# EAGLE design GPS_radiologger_v24_L70_CMWX_MAX_auto (EAGLE 9.6.2)
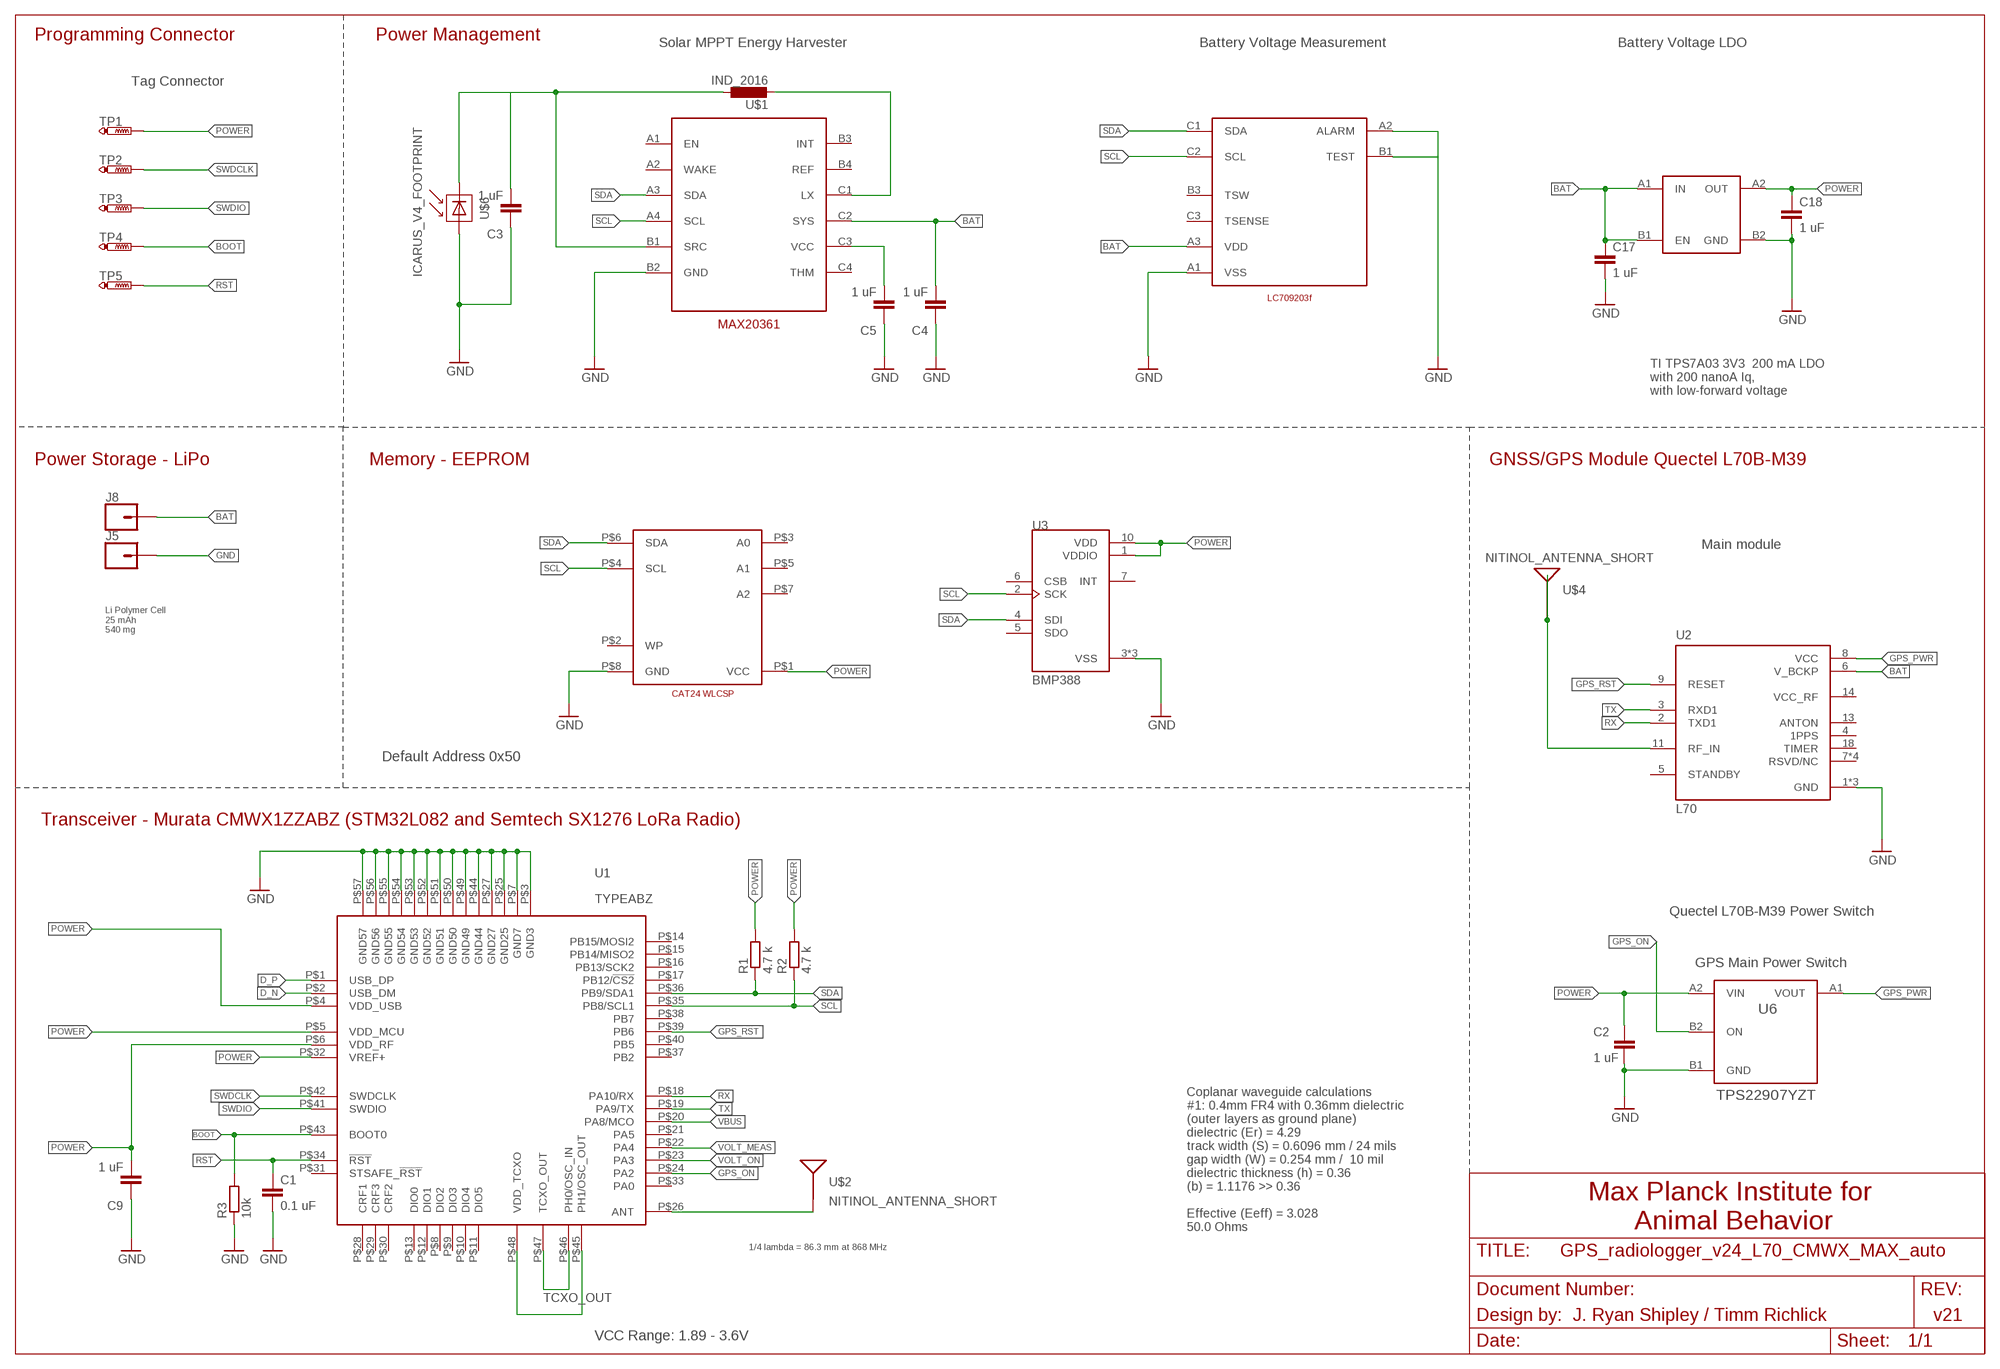
[diagram p0: schematic, sheet 1]

## Parts
C1  0.1 uF  C-EUC0201  [C0201]
C2  1 uF  C-EUC0201  [C0201]
C3  1 uF  C-EUC0201  [C0201]
C4  1 uF  C-EUC0201  [C0201]
C5  1 uF  C-EUC0201  [C0201]
C9  1 uF  C-EUC0201  [C0201]
C17  1 uF  0402CAP.KW  [0402-CAP]
C18  1 uF  0402CAP.KW  [0402-CAP]
J5  CONN_01PTH_NO_SILK_SMALL  [1X01_SMALL]
J8  CONN_01PTH_NO_SILK_SMALL  [1X01_SMALL]
R1  4.7 k  R-EU_R0201  [R0201]
R2  4.7 k  R-EU_R0201  [R0201]
R3  10k  R-EU_R0201  [R0201]
TP1  PTR1TP08SQ  [TP08SQ]
TP2  PTR1TP08SQ  [TP08SQ]
TP3  PTR1TP08SQ  [TP08SQ]
TP4  PTR1TP08SQ  [TP08SQ]
TP5  PTR1TP08SQ  [TP08SQ]
U1  TYPEABZ  [TYPEABZ]
U2  L70  [XCVR_L70]
U3  BMP388  [PQFN50P200X200X80-10N]
U6  TPS22907YZT  [YFP0004-DSBGA]
U$1  IND_2016  [INDC2016X120L]
U$2  NITINOL_ANTENNA_SHORT  [ICARUS_NITINOL_ANTENNA_SHORT]
U$3  TPS7A03-DSBGA  [BGA4N35P2X2_70X70X40N]
U$4  NITINOL_ANTENNA_SHORT  [ICARUS_NITINOL_ANTENNA_SHORT]
U$6  ICARUS_V4_FOOTPRINT  [ICARUS_FULL_FOOTPRINT]
U$7  LC709203F  [BGA9N50P3X3_160X175X50N]
U$8  MAX20361  [BGA12N40P4X3_123X163X64N]
U$9  CAT24_WLCSP8  [WLCSP8]

## Nets
BAT [battery]: C4.2 C17.1 J8.P$1 U2.6(V_BCKP) U$3.A1(IN) U$3.B1(EN) U$7.A3(VDD) U$8.C2(SYS)
BOOT: R3.2 TP4.TP U1.P$43(BOOT0)
D_N [diff_pair]: U1.P$2(USB_DM)
D_P [diff_pair]: U1.P$1(USB_DP)
GND: C1.2 C2.2 C3.1 C4.1 C5.1 C9.1 C17.2 C18.2 J5.P$1 R3.1 U1.P$3(GND3) U1.P$7(GND7) U1.P$25(GND25) U1.P$27(GND27) U1.P$44(GND44) U1.P$49(GND49) U1.P$50(GND50) U1.P$51(GND51) U1.P$52(GND52) U1.P$53(GND53) U1.P$54(GND54) U1.P$55(GND55) U1.P$56(GND56) U1.P$57(GND57) U2.1(GND) U2.10(GND) U2.12(GND) U3.3(VSS) U3.8(VSS) U3.9(VSS) U6.B1(GND) U$3.B2(GND) U$6.P$2(MINUS) U$7.A1(VSS) U$7.A2(ALARM) U$7.B1(TEST) U$8.B2(GND) U$9.P$8(GND)
GPS_ON: U1.P$24(PA2) U6.B2(ON)
GPS_PWR: U2.8(VCC) U6.A1(VOUT)
GPS_RST: U1.P$39(PB6) U2.9(RESET)
N$1: U1.P$45(PH1/OSC_OUT) U1.P$48(VDD_TCXO)
N$2 [antenna]: U2.11(RF_IN) U$4.1(SIGNAL) U$4.2(SIGNAL) U$4.3(SIGNAL)
N$3: U$1.2 U$8.C1(LX)
N$4: C5.2 U$8.C3(VCC)
N$11 [antenna]: U1.P$26(ANT) U$2.1(SIGNAL) U$2.2(SIGNAL) U$2.3(SIGNAL)
N$15 [battery]: C3.2 U$1.1 U$6.P$1(PLUS) U$8.B1(SRC)
POWER [power]: C2.1 C9.2 C18.1 R1.2 R2.2 TP1.TP U1.P$4(VDD_USB) U1.P$5(VDD_MCU) U1.P$6(VDD_RF) U1.P$32(VREF+) U3.1(VDDIO) U3.10(VDD) U6.A2(VIN) U$3.A2(OUT) U$9.P$1(VCC)
RST: C1.1 TP5.TP U1.P$34(!RST)
RX: U1.P$18(PA10/RX) U2.2(TXD1)
SCL: R2.1 U1.P$35(PB8/SCL1) U3.2(SCK) U$7.C2(SCL) U$8.A4(SCL) U$9.P$4(SCL)
SDA: R1.1 U1.P$36(PB9/SDA1) U3.4(SDI) U$7.C1(SDA) U$8.A3(SDA) U$9.P$6(SDA)
SWDCLK: TP2.TP U1.P$42(SWDCLK)
SWDIO: TP3.TP U1.P$41(SWDIO)
TCXO_OUT: U1.P$46(PH0/OSC_IN) U1.P$47(TCXO_OUT)
TX: U1.P$19(PA9/TX) U2.3(RXD1)
VBUS: U1.P$20(PA8/MCO)
VOLT_MEAS: U1.P$22(PA4)
VOLT_ON: U1.P$23(PA3)
Unconnected: U1.P$8(DIO2) U1.P$9(DIO3) U1.P$10(DIO4) U1.P$11(DIO5) U1.P$12(DIO1) U1.P$13(DIO0) U1.P$14(PB15/MOSI2) U1.P$15(PB14/MISO2) U1.P$16(PB13/SCK2) U1.P$17(PB12/!CS2) U1.P$21(PA5) U1.P$28(CRF1) U1.P$29(CRF3) U1.P$30(CRF2) U1.P$31(STSAFE_!RST) U1.P$33(PA0) U1.P$37(PB2) U1.P$38(PB7) U1.P$40(PB5) U2.4(1PPS) U2.5(STANDBY) U2.7(RSVD/NC) U2.13(ANTON) U2.14(VCC_RF) U2.15(RSVD/NC) U2.16(RSVD/NC) U2.17(RSVD/NC) U2.18(TIMER) U3.5(SDO) U3.6(CSB) U3.7(INT) U$7.B3(TSW) U$7.C3(TSENSE) U$8.A1(EN) U$8.A2(WAKE) U$8.B3(INT) U$8.B4(REF) U$8.C4(THM) U$9.P$2(WP) U$9.P$3(A0) U$9.P$5(A1) U$9.P$7(A2)

## Notes on the sheet
- Programming Connector | Power Management
- Solar MPPT Energy Harvester | Battery Voltage Measurement | Battery Voltage LDO
- Tag Connector
- TI TPS7A03 3V3  200 mA LDO
  with 200 nanoA Iq, 
  with low-forward voltage
- Power Storage - LiPo | Memory - EEPROM | GNSS/GPS Module Quectel L70B-M39
- Main module
- Li Polymer Cell
  25 mAh
  540 mg
- Default Address 0x50
- Transceiver - Murata CMWX1ZZABZ (STM32L082 and Semtech SX1276 LoRa Radio)
- Quectel L70B-M39 Power Switch
- GPS Main Power Switch
- Max Planck Institute for 
  Animal Behavior
- Coplanar waveguide calculations
  #1: 0.4mm FR4 with 0.36mm dielectric 
  (outer layers as ground plane)
  dielectric (Er) = 4.29
  track width (S) = 0.6096 mm / 24 mils
  gap width (W) = 0.254 mm /  10 mil
  dielectric thickness (h) = 0.36
  (b) = 1.1176 >> 0.36
  
  Effective (Eeff) = 3.028
  50.0 Ohms
- 1/4 lambda = 86.3 mm at 868 MHz
- Design by: | J. Ryan Shipley / Timm Richlick | v21
- VCC Range: 1.89 - 3.6V

## Library data of the parts
C1-C5 C9 = rcl:C-EU: CAPACITOR, European symbol; SPICEPREFIX: C
C17 C18 = SparkFun-Capacitors:0402CAP.KW
J5 J8 = SparkFun-Connectors:CONN_01: Single connection point. Often used as Generic Header-pin footprint for 0.1 inch spaced/style header connections On any of the 0.1 inch spaced packages, you can populate with these: Break Away Headers - Straight <https://www.sparkfun.com/products/116> (PRT-00116) Break Away Male Headers - Right Angle <https://www.sparkfun.com/products/553> (PRT-00553) Female Headers <https://www.sparkfun.com/products/115> (PRT-00115) Break Away Headers - Machine Pin <https://www.sparkfun.com/products/117> (PRT-00117) Break Away Female Headers - Swiss Machine Pin <https://www.sparkfun.com/products/743> (PRT-00743) This device is also useful as a general connection point to wire up your design to another part of your project. Our various solder wires solder well into these plated through hole pads. Hook-Up Wire - Assortment (Stranded, 22 AWG) <https://www.sparkfun.com/products/11375> (PRT-11375) Hook-Up Wire - Assortment (Solid Core, 22 AWG) <https://www.sparkfun.com/products/11367> (PRT-11367) View the entire wire category on our website here <https://www.sparkfun.com/categories/141> Special notes: SMTSO-256-ET is a "flush mount" nut for a 4-40 screw. We mostly use this on specialty testbeds; it is a nice way to connect hardware to your PCB at an adjustable hieght. Also note, the SNAP packages are for using a snappable style connector. We sell a baggie of snaps and they are also used on two LilyPad designs: Snap Assortment - 30 pack (male and female) <https://www.sparkfun.com/products/11347> (DEV-11347) LilyPad Arduino SimpleSnap <https://www.sparkfun.com/products/10941> (DEV-10941) LilyPad SimpleSnap Protoboard <https://www.sparkfun.com/products/10940> (DEV-10940)
R1-R3 = rcl:R-EU_: RESISTOR, European symbol; SPICEPREFIX: R
TP1-TP5 = testpad:PTR1: TEST PIN
U1 = Kris:TYPEABZ: CMWX1ZZABZ-078
U2 = L70:L70: GPS Module Check prices <https://pricing.snapeda.com/parts/L70/Quectel/view-part?ref=eda>; AVAILABILITY: Warning; DESCRIPTION: L70, an SMD type module, brings the high performance of MTK positioning engine to the industrial applications with compact profile, ultra low power consumption and fast positioning capability.; MF: Quectel; MP: L70; PACKAGE: 2920 Quectel; PRICE: None
U3 = BMP388:BMP388: P-Sensor SPI I2C 1, 25 Bar SMD; AVAILABILITY: Unavailable; DESCRIPTION: Pressure Sensor 4.35PSI ~ 18.13PSI (30kPa ~ 125kPa) Absolute 10-WFLGA; MF: Bosch Sensortec; MP: BMP388; PACKAGE: WFLGA-10 Bosch Tools; PRICE: None
U6 = TPS22916:TPS22907YZT
U$1 = Ryan_custom:IND_2016
U$2 U$4 = Antenna_mounts:NITINOL_ANTENNA_SHORT
U$3 = Ryan_custom:TPS7A03-DSBGA
U$6 = TrisolX_Solar_Cells:ICARUS_V4_FOOTPRINT
U$7 = Ryan_custom:LC709203F
U$8 = Ryan_custom:MAX20361
U$9 = Ryan_custom:CAT24_WLCSP8

## Net classes
1 power: width 0.152 mm
2 antenna: width 0.61 mm, clearance 0.254 mm
3 battery: width 0.152 mm
4 diff_pair: width 0.178 mm, clearance 0.152 mm

## Board
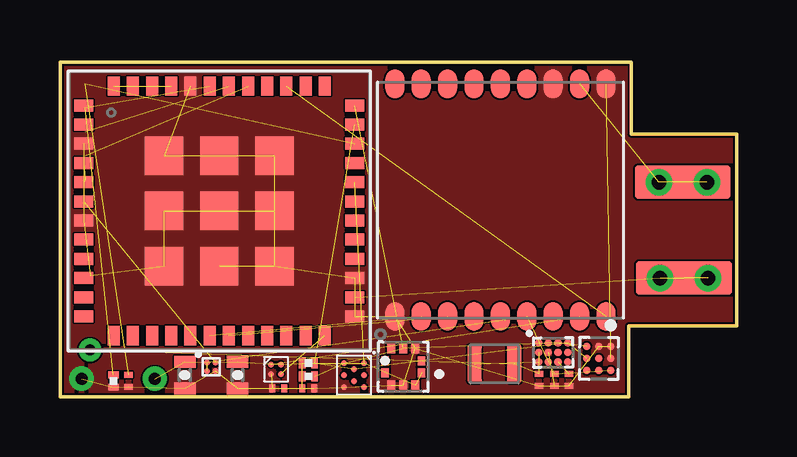
[diagram p1: board, top side]
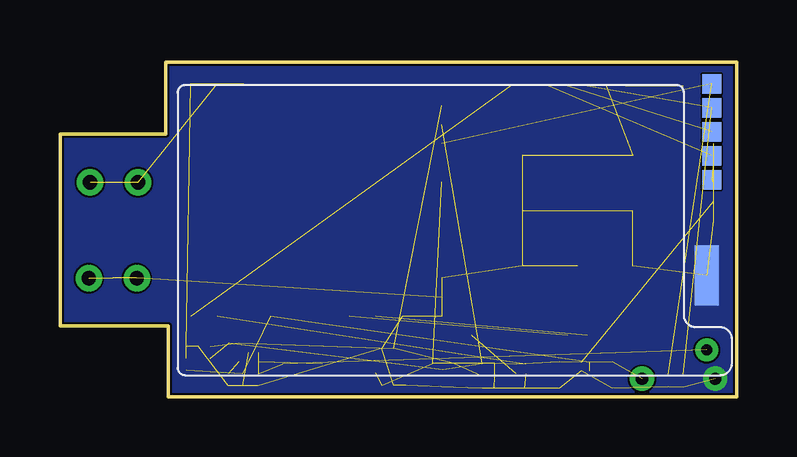
[diagram p2: board, bottom side, seen from below]

Size 28.2 x 13.95 mm. Coordinates in mm from the lower left corner, seen from the top.
Outline: 0,13.95 23.8,13.95 23.8,10.95 28.2,10.95 28.2,2.95 23.7,2.95 23.7,0 0,0 0,13.95
Copper layers (1*2+15*16): Top 0.035mm / dielectric 0.08mm / Route2 0.035mm / dielectric 0.08mm / Route15 0.035mm / dielectric 0.11mm / Bottom 0.035mm
Design rules "default *": minimum track width 5mil, minimum drill 0.15mm, track to track 3mil, track to pad 3mil, pad to pad 3mil, via to via 3mil, smd to smd 3mil, copper to edge 3mil, drill to drill 3mil, minimum pad ring 10mil, minimum via ring 3mil, stop-mask expansion 0mil, vias tented up to drill 20mil, thermal gap 0mil

### Footprints (pad centres in the part's own frame; a part is rotated, then mirrored left to right if it is on the bottom)
C0201 = smd 0.25 x 0.35: 1 -0.25,0; 2 0.25,0
0402-CAP = smd 0.5 x 0.9: 1 -0.55,0; 2 0.55,0
1X01_SMALL = drill 0.508: P$1 0,0
R0201 = smd 0.28 x 0.43: 1 -0.255,0; 2 0.255,0
TP08SQ = smd 0.8 x 0.8: TP 0,0
TYPEABZ = smd 0.8 x 0.5: P$1 -5.65,4.4; P$2 -5.65,3.6; P$3 -5.65,2.8; P$4 -5.65,2; P$5 -5.65,1.2; P$6 -5.65,0.4; P$7 -5.65,-0.4; P$8 -5.65,-1.2; P$9 -5.65,-2; P$10 -5.65,-2.8; P$11 -5.65,-3.6; P$12 -5.65,-4.4; P$25 5.65,-4.4; P$26 5.65,-3.6; P$27 5.65,-2.8; P$28 5.65,-2; P$29 5.65,-1.2; P$30 5.65,-0.4; P$31 5.65,0.4; P$32 5.65,1.2; P$33 5.65,2; P$34 5.65,2.8; P$35 5.65,3.6; P$36 5.65,4.4 | smd 0.5 x 0.8: P$13 -4.4,-5.2; P$14 -3.6,-5.2; P$15 -2.8,-5.2; P$16 -2,-5.2; P$17 -1.2,-5.2; P$18 -0.4,-5.2; P$19 0.4,-5.2; P$20 1.2,-5.2; P$21 2,-5.2; P$22 2.8,-5.2; P$23 3.6,-5.2; P$24 4.4,-5.2; P$37 4.4,5.2; P$38 3.6,5.2; P$39 2.8,5.2; P$40 2,5.2; P$41 1.2,5.2; P$42 0.4,5.2; P$43 -0.4,5.2; P$44 -1.2,5.2; P$45 -2,5.2; P$46 -2.8,5.2; P$47 -3.6,5.2; P$48 -4.4,5.2 | smd 1.6 x 1.6: P$49 -2.3,2.3; P$50 0,2.3; P$51 2.3,2.3; P$52 -2.3,0; P$53 0,0; P$54 2.3,0; P$55 -2.3,-2.3; P$56 0,-2.3; P$57 2.3,-2.3
XCVR_L70 = smd 1.2 x 0.8: 1 -4.85,4.4; 2 -4.85,3.3; 3 -4.85,2.2; 4 -4.85,1.1; 5 -4.85,0; 6 -4.85,-1.1; 7 -4.85,-2.2; 8 -4.85,-3.3; 9 -4.85,-4.4; 10 4.85,-4.4; 11 4.85,-3.3; 12 4.85,-2.2; 13 4.85,-1.1; 14 4.85,0; 15 4.85,1.1; 16 4.85,2.2; 17 4.85,3.3; 18 4.85,4.4
PQFN50P200X200X80-10N = smd 0.35 x 0.38: 1 -0.765,0.25; 2 -0.765,-0.25; 3 -0.5,-0.765; 4 0,-0.765; 5 0.5,-0.765; 6 0.765,-0.25; 7 0.765,0.25; 8 0.5,0.765; 9 0,0.765; 10 -0.5,0.765
YFP0004-DSBGA = smd 0.25 x 0.25: A1 0.2,-0.2; A2 -0.2,-0.2; B1 0.2,0.2; B2 -0.2,0.2
INDC2016X120L = smd 0.6 x 1.612: 1 -0.825,0; 2 0.825,0
ICARUS_NITINOL_ANTENNA_SHORT = smd 4 x 1.4: 1 0,0 | drill 0.6: 2 -1,0; 3 1,0
BGA4N35P2X2_70X70X40N = smd 0.26 x 0.26: A1 -0.175,0.175; A2 0.175,0.175; B1 -0.175,-0.175; B2 0.175,-0.175
ICARUS_FULL_FOOTPRINT = drill 0.45: P$1 5,11.5 | smd 2.5 x 1: P$2 1.9,11.5
BGA9N50P3X3_160X175X50N = smd 0.32 x 0.32: A1 -0.5,0.5; A2 0,0.5; A3 0.5,0.5; B1 -0.5,0; B2 0,0; B3 0.5,0; C1 -0.5,-0.5; C2 0,-0.5; C3 0.5,-0.5
BGA12N40P4X3_123X163X64N = smd 0.32 x 0.32: A1 -0.6,0.4; A2 -0.2,0.4; A3 0.2,0.4; A4 0.6,0.4; B1 -0.6,0; B2 -0.2,0; B3 0.2,0; B4 0.6,0; C1 -0.6,-0.4; C2 -0.2,-0.4; C3 0.2,-0.4; C4 0.6,-0.4
WLCSP8 = smd 0.24 x 0.24: P$1 -0.5,0.425; P$2 0,0.425; P$3 0.5,0.425; P$4 -0.25,0; P$5 0.25,0; P$6 -0.5,-0.425; P$7 0,-0.425; P$8 0.5,-0.425

### Placement (x,y rotation side)
C1  2.85,0.66 270 top
C2  9.1,0.35 180 top
C3  19.95,0.7 90 top
C4  20.6,0.7 90 top
C5  21.2,0.7 90 top
C9  10.35,0.35 180 top
C17  5.2,0.9 270 top
C18  7.4,0.9 270 top
J5  0.9,0.75 0 top
J8  3.95,0.75 180 top
R1  10.35,0.85 180 top
R2  10.35,1.4 180 top
R3  2.23,0.65 90 top
TP1  1.05,9.05 0 bottom
TP2  1.05,11.05 0 bottom
TP3  1.05,10.05 0 bottom
TP4  1.05,12.05 0 bottom
TP5  1.05,13.05 0 bottom
U1  6.64,7.75 0 top
U2  18.35,8.2 90 top
U3  14.3,1.25 180 top
U6  9,1.15 180 top
U$1  18.1,1.38 180 top
U$2  26,4.95 0 top
U$3  6.3,1.25 0 top
U$4  25.95,8.95 180 top
U$6  12.75,6.95 270 bottom
U$7  22.45,1.6 270 top
U$8  20.55,1.85 0 top
U$9  12.25,0.9 270 top

### Tracks (layer width: path | path; a pad name or v marks a point on that pad's centre or on a via)
BAT  (7 unrouted)
BOOT  (2 unrouted)
GND  (37 unrouted)
  pour Top: -0.51,14.53 30.11,14.53 30.11,-1.2 -0.51,-1.2
  pour Bottom: -0.55,14.65 30.5,14.65 30.5,-1.8 -0.55,-1.8
GPS_ON  (1 unrouted)
GPS_PWR  (1 unrouted)
GPS_RST  (1 unrouted)
N$1  (1 unrouted)
N$2  (3 unrouted)
N$3  (1 unrouted)
N$4  (1 unrouted)
N$11  (3 unrouted)
N$15  (3 unrouted)
POWER  (14 unrouted)
RST  (2 unrouted)
RX  (1 unrouted)
SCL  (5 unrouted)
SDA  (5 unrouted)
SWDCLK  (1 unrouted)
SWDIO  (1 unrouted)
TCXO_OUT  (1 unrouted)
TX  (1 unrouted)